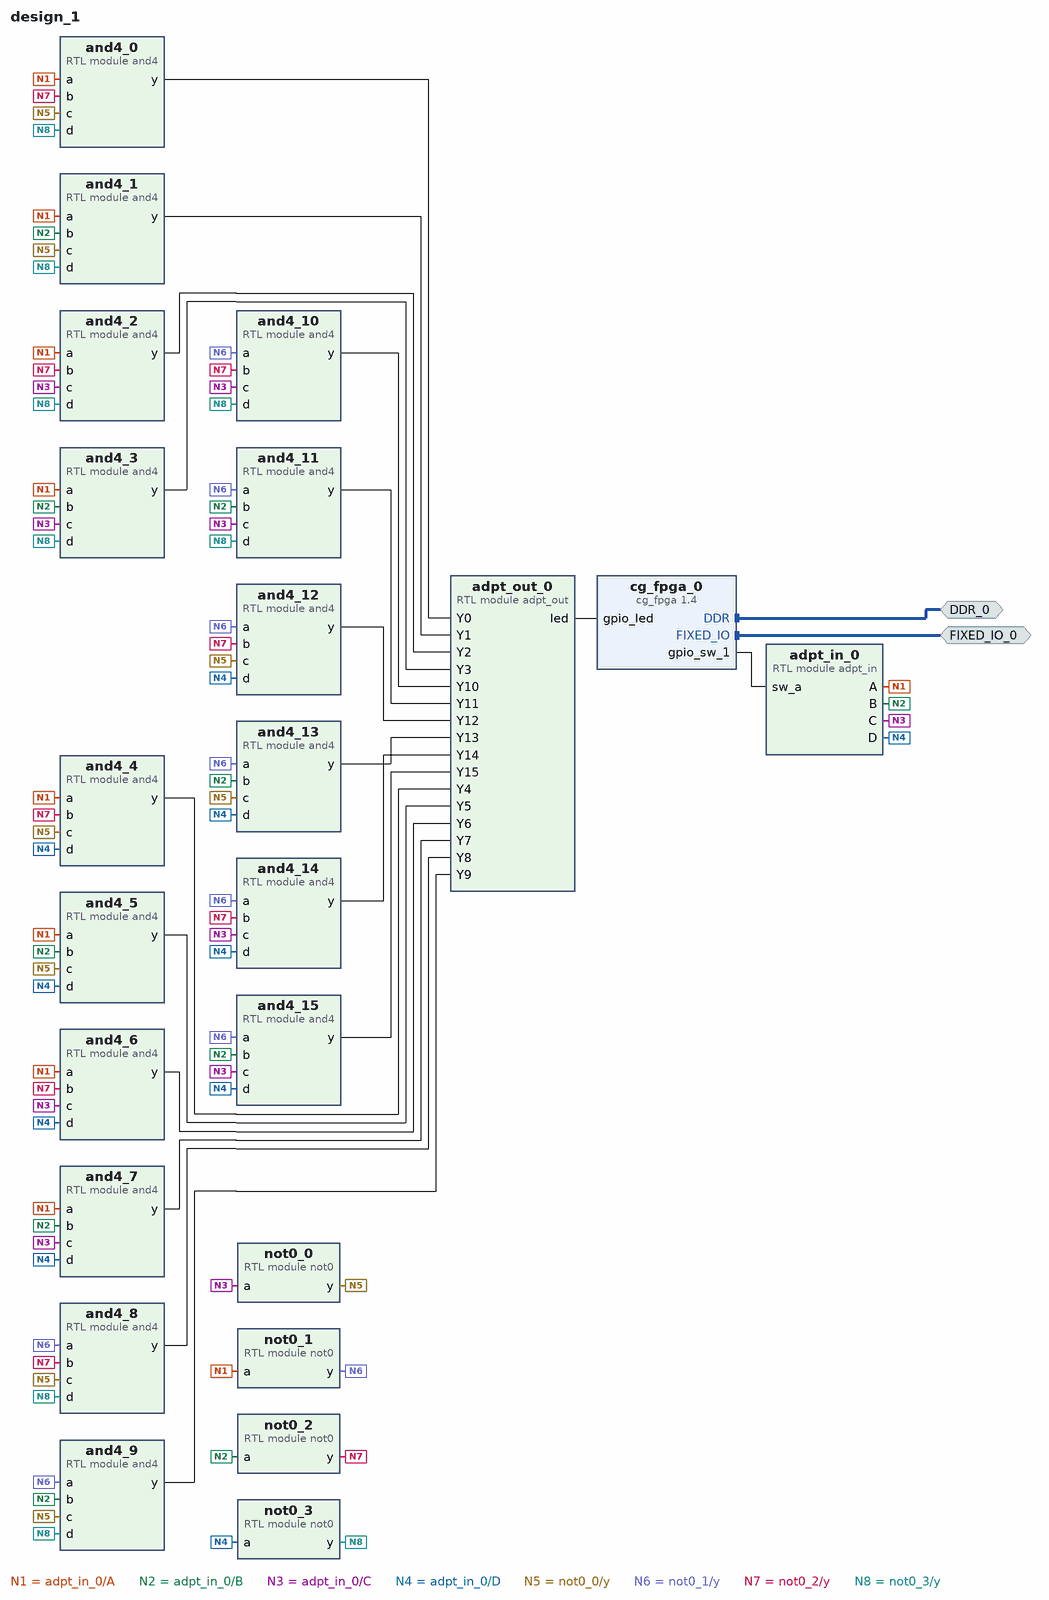
[diagram p0: block diagram of the top level]
# Vivado block design design_1, xc7z020clg400-1, Vivado 2024.2
create_bd_design design_1

create_bd_intf_port -mode Master -vlnv xilinx.com:display_processing_system7:fixedio_rtl:1.0 FIXED_IO_0
create_bd_intf_port -mode Master -vlnv xilinx.com:interface:ddrx_rtl:1.0 DDR_0

create_bd_cell -type ip -vlnv educg.net:user:cg_fpga:1.4 cg_fpga_0
create_bd_cell -type module -reference adpt_in adpt_in_0
create_bd_cell -type module -reference adpt_out adpt_out_0
create_bd_cell -type module -reference not0 not0_0
create_bd_cell -type module -reference and4 and4_0
create_bd_cell -type module -reference not0 not0_2
create_bd_cell -type module -reference not0 not0_3
create_bd_cell -type module -reference and4 and4_1
create_bd_cell -type module -reference and4 and4_2
create_bd_cell -type module -reference and4 and4_3
create_bd_cell -type module -reference and4 and4_4
create_bd_cell -type module -reference and4 and4_5
create_bd_cell -type module -reference and4 and4_6
create_bd_cell -type module -reference and4 and4_7
create_bd_cell -type module -reference not0 not0_1
create_bd_cell -type module -reference and4 and4_8
create_bd_cell -type module -reference and4 and4_9
create_bd_cell -type module -reference and4 and4_10
create_bd_cell -type module -reference and4 and4_11
create_bd_cell -type module -reference and4 and4_12
create_bd_cell -type module -reference and4 and4_13
create_bd_cell -type module -reference and4 and4_14
create_bd_cell -type module -reference and4 and4_15

# ---- connections ----

connect_bd_intf_net [get_bd_intf_ports DDR_0] [get_bd_intf_pins cg_fpga_0/DDR]
connect_bd_intf_net [get_bd_intf_ports FIXED_IO_0] [get_bd_intf_pins cg_fpga_0/FIXED_IO]
connect_bd_net [get_bd_pins adpt_in_0/A] \
  [get_bd_pins and4_0/a] [get_bd_pins and4_1/a] [get_bd_pins and4_2/a] [get_bd_pins and4_3/a] [get_bd_pins and4_4/a] \
  [get_bd_pins and4_5/a] [get_bd_pins and4_6/a] [get_bd_pins and4_7/a] [get_bd_pins not0_1/a]
connect_bd_net [get_bd_pins adpt_in_0/B] \
  [get_bd_pins and4_1/b] [get_bd_pins and4_9/b] [get_bd_pins and4_3/b] [get_bd_pins and4_11/b] [get_bd_pins and4_5/b] \
  [get_bd_pins and4_13/b] [get_bd_pins and4_7/b] [get_bd_pins and4_15/b] [get_bd_pins not0_2/a]
connect_bd_net [get_bd_pins adpt_in_0/C] \
  [get_bd_pins and4_2/c] [get_bd_pins and4_10/c] [get_bd_pins and4_3/c] [get_bd_pins and4_11/c] [get_bd_pins and4_6/c] \
  [get_bd_pins and4_14/c] [get_bd_pins and4_7/c] [get_bd_pins and4_15/c] [get_bd_pins not0_0/a]
connect_bd_net [get_bd_pins adpt_in_0/D] \
  [get_bd_pins and4_4/d] [get_bd_pins and4_12/d] [get_bd_pins and4_5/d] [get_bd_pins and4_13/d] [get_bd_pins and4_6/d] \
  [get_bd_pins and4_14/d] [get_bd_pins and4_7/d] [get_bd_pins and4_15/d] [get_bd_pins not0_3/a]
connect_bd_net [get_bd_pins adpt_out_0/led] [get_bd_pins cg_fpga_0/gpio_led]
connect_bd_net [get_bd_pins and4_0/y] [get_bd_pins adpt_out_0/Y0]
connect_bd_net [get_bd_pins and4_10/y] [get_bd_pins adpt_out_0/Y10]
connect_bd_net [get_bd_pins and4_11/y] [get_bd_pins adpt_out_0/Y11]
connect_bd_net [get_bd_pins and4_12/y] [get_bd_pins adpt_out_0/Y12]
connect_bd_net [get_bd_pins and4_13/y] [get_bd_pins adpt_out_0/Y13]
connect_bd_net [get_bd_pins and4_14/y] [get_bd_pins adpt_out_0/Y14]
connect_bd_net [get_bd_pins and4_15/y] [get_bd_pins adpt_out_0/Y15]
connect_bd_net [get_bd_pins and4_1/y] [get_bd_pins adpt_out_0/Y1]
connect_bd_net [get_bd_pins and4_2/y] [get_bd_pins adpt_out_0/Y2]
connect_bd_net [get_bd_pins and4_3/y] [get_bd_pins adpt_out_0/Y3]
connect_bd_net [get_bd_pins and4_4/y] [get_bd_pins adpt_out_0/Y4]
connect_bd_net [get_bd_pins and4_5/y] [get_bd_pins adpt_out_0/Y5]
connect_bd_net [get_bd_pins and4_6/y] [get_bd_pins adpt_out_0/Y6]
connect_bd_net [get_bd_pins and4_7/y] [get_bd_pins adpt_out_0/Y7]
connect_bd_net [get_bd_pins and4_8/y] [get_bd_pins adpt_out_0/Y8]
connect_bd_net [get_bd_pins and4_9/y] [get_bd_pins adpt_out_0/Y9]
connect_bd_net [get_bd_pins cg_fpga_0/gpio_sw_1] [get_bd_pins adpt_in_0/sw_a]
connect_bd_net [get_bd_pins not0_0/y] \
  [get_bd_pins and4_0/c] [get_bd_pins and4_8/c] [get_bd_pins and4_1/c] [get_bd_pins and4_9/c] [get_bd_pins and4_4/c] \
  [get_bd_pins and4_12/c] [get_bd_pins and4_5/c] [get_bd_pins and4_13/c]
connect_bd_net [get_bd_pins not0_1/y] \
  [get_bd_pins and4_8/a] [get_bd_pins and4_9/a] [get_bd_pins and4_10/a] [get_bd_pins and4_11/a] [get_bd_pins and4_12/a] \
  [get_bd_pins and4_13/a] [get_bd_pins and4_14/a] [get_bd_pins and4_15/a]
connect_bd_net [get_bd_pins not0_2/y] \
  [get_bd_pins and4_0/b] [get_bd_pins and4_8/b] [get_bd_pins and4_2/b] [get_bd_pins and4_10/b] [get_bd_pins and4_4/b] \
  [get_bd_pins and4_12/b] [get_bd_pins and4_6/b] [get_bd_pins and4_14/b]
connect_bd_net [get_bd_pins not0_3/y] \
  [get_bd_pins and4_0/d] [get_bd_pins and4_8/d] [get_bd_pins and4_1/d] [get_bd_pins and4_9/d] [get_bd_pins and4_2/d] \
  [get_bd_pins and4_10/d] [get_bd_pins and4_3/d] [get_bd_pins and4_11/d]

validate_bd_design
save_bd_design
